# EAGLE schematic PPM2MultiRF (EAGLE 7.2.0)
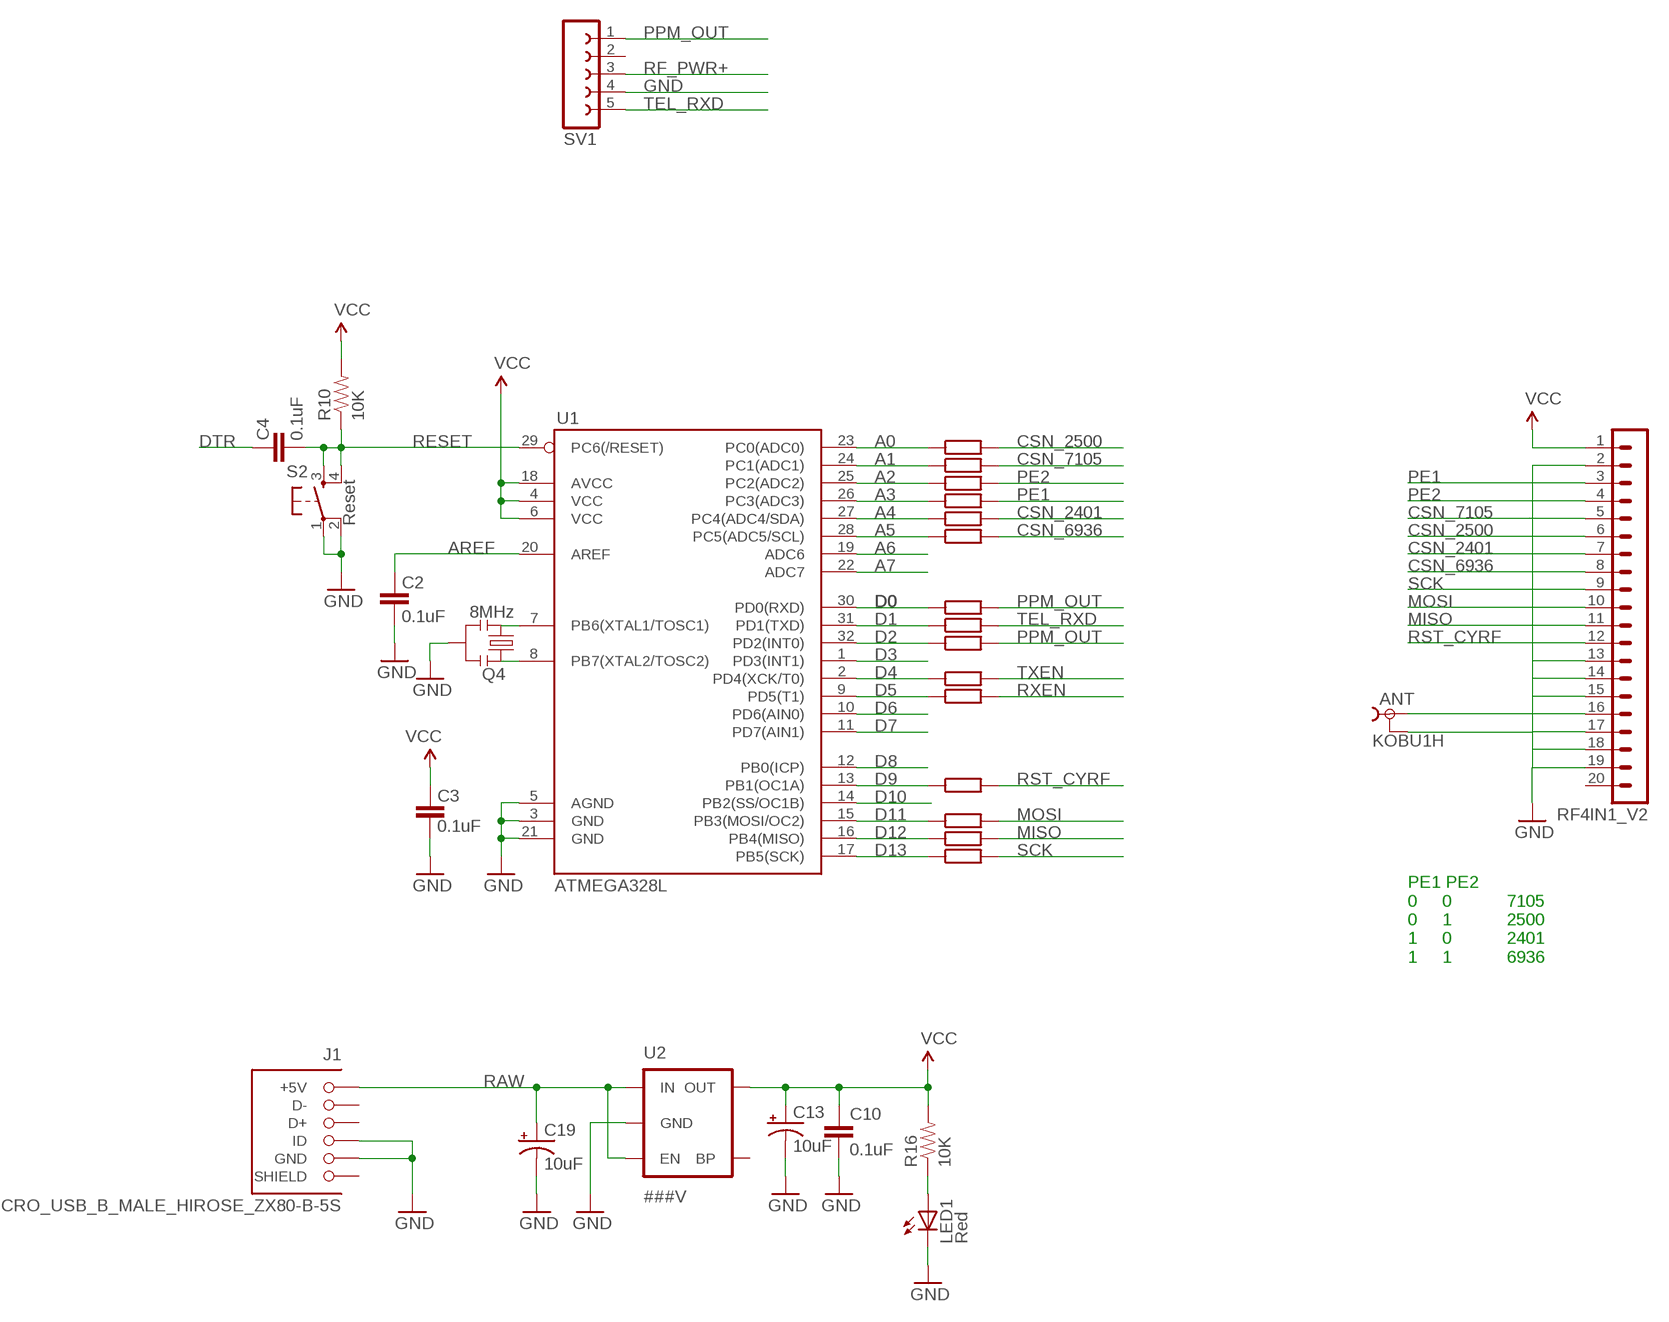
[diagram p0: schematic, sheet 1]

## Parts
ANT  KOBU1H  [KOBU1H]
C2  0.1uF  CAP0402  [C0402]
C3  0.1uF  CAP0402  [C0402]
C4  0.1uF  CAP0402  [C0402]
C10  0.1uF  CAP0402  [C0402]
C13  10uF  CAP_POL1206  [EIA3216]
C19  10uF  CAP_POL1206  [EIA3216]
J1  MICRO_USB_B_MALE_HIROSE_ZX80-B-5S  [USB_MICRO_B_MALE-HIROSE-ZX80-B-5S]
LED1  Red  LED0603  [LED-0603]
Q4  8MHz  RESONATORSMD  [RESONATOR-SMD]
R10  10K  RESISTOR0402  [C0402]
R16  10K  RESISTOR0402  [C0402]
RF4IN1_V2  MA20-1  [MA20-1]
S2  Reset  TAC_SWITCHSND  [TACTILE_SWITCH_SMD]
SV1  FE05W  [FE05W]
U1  ATMEGA328L  ATMEGA168  [TQFP32-08]
U2  ###V  V_REG_LDOSMD  [SOT23-5]

## Nets
3.3V: RF4IN1_V2.1 ; supply symbol labelled VCC
A0: U1.23(PC0(ADC0))
A1: U1.24(PC1(ADC1))
A2: U1.25(PC2(ADC2))
A3: U1.26(PC3(ADC3))
A4: U1.27(PC4(ADC4/SDA))
A5: U1.28(PC5(ADC5/SCL))
A6: U1.19(ADC6)
A7: U1.22(ADC7)
AREF: C2.2 U1.20(AREF)
CSN_2401: RF4IN1_V2.7
CSN_2500: RF4IN1_V2.6
CSN_6936: RF4IN1_V2.8
CSN_7105: RF4IN1_V2.5
D0: U1.30(PD0(RXD))
D1: U1.31(PD1(TXD))
D2: U1.32(PD2(INT0))
D3: U1.1(PD3(INT1))
D4: U1.2(PD4(XCK/T0))
D5: U1.9(PD5(T1))
D6: U1.10(PD6(AIN0))
D7: U1.11(PD7(AIN1))
D8: U1.12(PB0(ICP))
D9: U1.13(PB1(OC1A))
D10: U1.14(PB2(SS/OC1B))
D11: U1.15(PB3(MOSI/OC2))
D12: U1.16(PB4(MISO))
D13: U1.17(PB5(SCK))
DTR: C4.2
GND: ANT.2 ANT.2@1 C2.1 C3.1 C10.2 C13.C(-) C19.C(-) J1.4(ID) J1.5(GND) LED1.C Q4.2 RF4IN1_V2.2 RF4IN1_V2.13 RF4IN1_V2.14 RF4IN1_V2.15 RF4IN1_V2.17 RF4IN1_V2.18 RF4IN1_V2.19 S2.1 S2.2 SV1.4 U1.3(GND) U1.5(AGND) U1.21(GND) U2.2(GND)
MISO: RF4IN1_V2.11
MOSI: RF4IN1_V2.10
N$3: ANT.1 RF4IN1_V2.16
N$11: Q4.1 U1.8(PB7(XTAL2/TOSC2))
N$12: Q4.3 U1.7(PB6(XTAL1/TOSC1))
N$38: LED1.A R16.1
PE1: RF4IN1_V2.3
PE2: RF4IN1_V2.4
PPM_OUT: SV1.1
RAW [vcc]: C19.A(+) J1.1(+5V) U2.1(IN) U2.3(EN)
RESET: C4.1 R10.1 S2.3 S2.4 U1.29(PC6(/RESET))
RF_PWR+: SV1.3
RST_CYRF: RF4IN1_V2.12
SCK: RF4IN1_V2.9
TEL_RXD: SV1.5
VCC: C3.2 C10.1 C13.A(+) R10.2 R16.2 U1.4(VCC) U1.6(VCC) U1.18(AVCC) U2.5(OUT)
Unconnected: J1.2(D-) J1.3(D+) J1.SHIELD1(SHIELD) J1.SHIELD2(SHIELD) J1.SHIELD3(SHIELD) J1.SHIELD4(SHIELD) RF4IN1_V2.20 SV1.2 U2.4(BP)

## Notes on the sheet
- PE1 PE2
  0     0           7105
  0     1           2500
  1     0           2401
  1     1           6936

## Library data of the parts
ANT = con-hirschmann:KOBU1H: Female RF CONNECTOR horizontal; OC_FARNELL: unknown; OC_NEWARK: unknown
C2-C4 C10 = SparkFun:CAP: Capacitor Standard 0603 ceramic capacitor, and 0.1" leaded capacitor.
C13 C19 = SparkFun:CAP_POL: Capacitor Polarized These are standard SMD and PTH capacitors. Normally 10uF, 47uF, and 100uF in electrolytic and tantalum varieties. Always verify the external diameter of the through hole cap, it varies with capacity, voltage, and manufacturer. The EIA devices should be standard.
J1 = connector:MICRO_USB_B_MALE_HIROSE_ZX80-B-5S: CONN PLUG MCR USB B PCB VERT; DIGIKEY: H11612-ND
LED1 = SparkFun:LED: LEDs Standard schematic elements and footprints for 5mm, 3mm, 1206, and 0603 sized LEDs. 5mm - Spark Fun Electronics SKU : COM-00529 (and others)
Q4 = SparkFun:RESONATOR: Resonator Small SMD resonator. This is the itty bitty 10/20MHz resonators with built in caps. CSTCE10M0G55 and CSTCE20M0V53. Footprint has been reviewed closely but hasn't been tested yet.
R10 R16 = SparkFun:RESISTOR: Resistor Basic schematic elements and footprints for 0603, 1206, and PTH 1/10th watt (small) resistors.
RF4IN1_V2 = con-lstb:MA20-1: PIN HEADER; OC_FARNELL: unknown; OC_NEWARK: unknown
S2 = SparkFun:TAC_SWITCH: Momentary Switch Button commonly used for reset or general input. Spark Fun Electronics SKU : COM-00097
SV1 = con-lsta:FE05W: FEMALE HEADER; OC_FARNELL: unknown; OC_NEWARK: unknown
U1 = SparkFun:ATMEGA168
U2 = SparkFun:V_REG_LDO: Voltage Regulator LDO Standard 150mA LDO voltage regulator in SOT-23 layout. Micrel part MIC5205. BP (by-pass) pin is used to lower output noise with 470pF cap.

## Net classes
1 vcc: width 0.254 mm